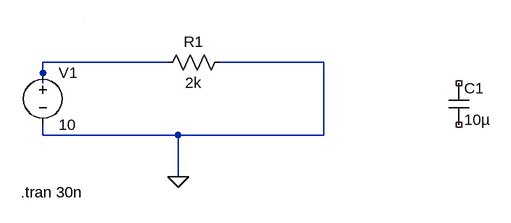
[diagram p0: schematic RC_circuit2.asc]
RC_circuit2.asc, the LTspice schematic file:
Version 4
SHEET 1 880 680
WIRE 128 64 -64 64
WIRE 368 64 208 64
WIRE -64 80 -64 64
WIRE -64 96 -64 80
WIRE 368 176 368 64
WIRE -64 176 -64 160
WIRE 144 176 -64 176
WIRE 368 176 144 176
WIRE 144 240 144 176
WIRE 0 0 0 0
FLAG 144 240 0
SYMBOL res 224 48 R90
WINDOW 0 0 56 VBottom 2
WINDOW 3 32 56 VTop 2
SYMATTR InstName R1
SYMATTR Value 2k
SYMBOL cap 560 96 R0
SYMATTR InstName C1
SYMATTR Value 10µ
SYMBOL voltage -64 64 R0
WINDOW 123 0 0 Left 2
WINDOW 39 0 0 Left 2
SYMATTR InstName V1
SYMATTR Value 10
TEXT -98 264 Left 2 !.tran 30n

The netlist it stands for:
* RC_circuit2.asc
R1 0 N001 2k
C1 NC_01 NC_02 10µ
V1 N001 0 10
.tran 30n
.backanno
.end